# Altium project LoRaIoT.PrjPcb (part 3 of 3)

## Sheet [6] SENSORS.SchDoc: Sensors
size A4; CompanyName: RADWAG Wagi Elektroniczne; Organization: RADWAG Wagi Elektroniczne; Address1: ul. Bracka 28; Address2: 26-600 RADOM; Address3: POLAND; SheetNumber: 6; SheetTotal: 6
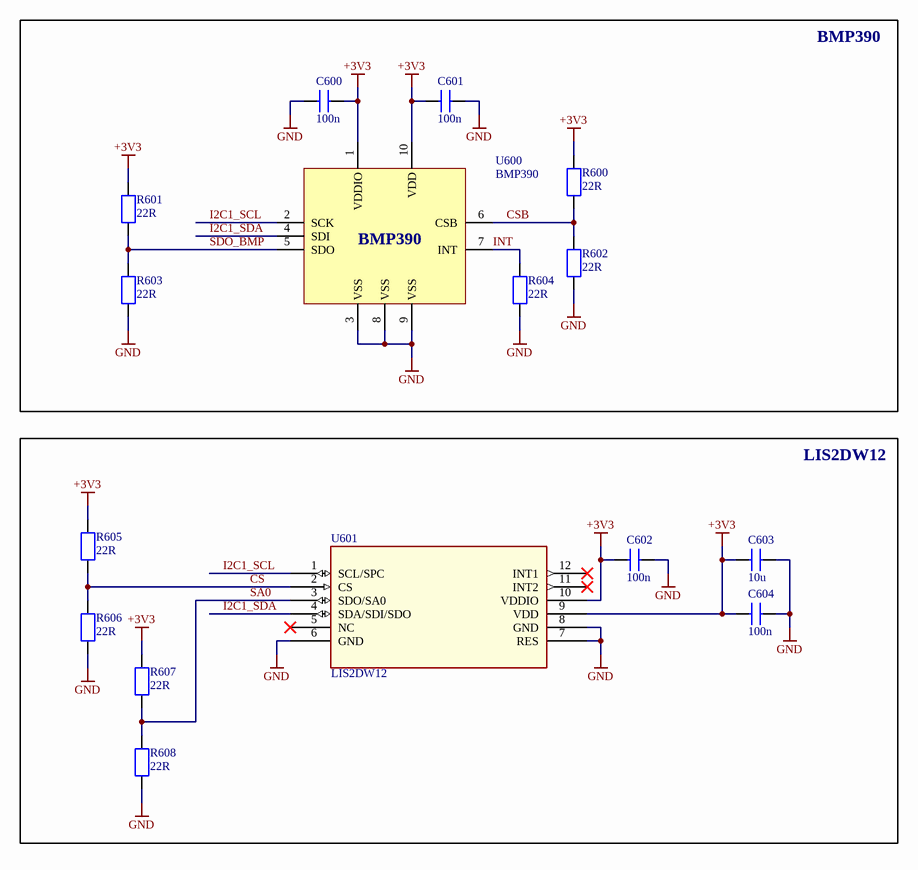
[diagram p5: [6] SENSORS.SchDoc]

### Parts
C600  100n  [C0402]
C601  100n  [C0402]
C602  100n  [C0402]
C603  10u  [C0402]
C604  100n  [C0402]
R600  22R  [R0603]
R601  22R  [R0603]
R602  22R  [R0603]
R603  22R  [R0603]
R604  22R  [R0603]
R605  22R  [R0603]
R606  22R  [R0603]
R607  22R  [R0603]
R608  22R  [R0603]
U600  BMP390  [LGA10]
U601  LIS2DW12  [LGA12]

### Blocks framed on the sheet
BMP390: C600 C601 R600-R604 U600
LIS2DW12: C602-C604 R605-R608 U601

### Nets
+3V3: C600.1 C601.2 C602.2 C603.2 C604.2 R600.2 R601.2 R605.2 R607.2 U600.1(VDDIO) U600.10(VDD) U601.9(VDD) U601.10(VDDIO)
GND: C600.2 C601.1 C602.1 C603.1 C604.1 R602.1 R603.1 R604.1 R606.1 R608.1 U600.3(VSS) U600.8(VSS) U600.9(VSS) U601.6(GND) U601.7(RES) U601.8(GND)
CS: R605.1 R606.2 U601.2(CS)
CSB: R600.1 R602.2 U600.6(CSB)
I2C1_SCL: U600.2(SCK) U601.1(SCL/SPC)
I2C1_SDA: U600.4(SDI) U601.4(SDA/SDI/SDO)
INT: R604.2 U600.7(INT)
SA0: R607.1 R608.2 U601.3(SDO/SA0)
SDO_BMP: R601.1 R603.2 U600.5(SDO)

Not connected (* = marked no-connect by the designer): U601 5(NC)* 11(INT2)* 12(INT1)*

### Notes on the sheet
- Title:
- Size: A4
- Page contents:
- Date:
- Version:
- Drawn by:
- Issue:
- Sheet number:
- of

### Library data of the parts
C600-C602 C604 = 04023C104KAT2A: Multilayer Ceramic Capacitor, 0.1 uF, 25 V, ± 10%, X7R, 0402 [1005 Metric]; Manufacturer: Kyocera AVX; Material: 4241ConductorMaterial; Value: 100nF; Voltage Rating: 25V; Supplier: Arrow Electronics; Supplier Part Number: 04023C104KAT2A; Manufacturer Part Number: 04023C104KAT2A; RoHS: Yes; Category: Ceramic Capacitors; Stock: 5700000; Pricing: 10000=0,0064, 20000=0,0061, 30000=0,0058, 50000=0,0052, 100000=0,0042, 150000=0,0038 (USD); Mounting Technology: Surface Mount; Case/Package: 0402; Pins: 2; Case Code (Metric): 1005; Case Code (Imperial): 0402; Min Operating Temperature: -55°C; Max Operating Temperature: 125°C; Tolerance: 10%; Dielectric: X7R; Packaging: Cut Tape; Voltage Rating (DC): 25V; Voltage: 25V; Series: -; Width: 1mm; Reach SVHC Compliant: No; Lead Free: Lead Free; RoHS Compliant: Yes; ComponentLink1URL: https://datasheet.ciiva.com/6265/cx7r-6265272.pdf?src-supplier=Digi-Key; ComponentLink1Description: https://datasheet.ciiva.com/6265/cx7r-6265272.pdf?src-supplier=Digi-Key; ComponentLink2URL: https://datasheet.ciiva.com/1123/1679506-1123344.pdf?src-supplier=Element14; ComponentLink2Description: https://datasheet.ciiva.com/1123/1679506-1123344.pdf?src-supplier=Element14; ComponentLink3URL: https://datasheet.ciiva.com/7709/1679506-7709527.pdf?src-supplier=Element14; ComponentLink3Description: https://datasheet.ciiva.com/7709/1679506-7709527.pdf?src-supplier=Element14; ComponentLink4URL: https://datasheet.ciiva.com/14906/cx7r-14906223.pdf?src-supplier=Digi-Key; ComponentLink4Description: https://datasheet.ciiva.com/14906/cx7r-14906223.pdf?src-supplier=Digi-Key; ComponentLink5URL: https://datasheet.ciiva.com/7614/cx7r-7614663.pdf?src-supplier=Digi-Key; ComponentLink5Description: https://datasheet.ciiva.com/7614/cx7r-7614663.pdf?src-supplier=Digi-Key
C603 = GRJ155R60J106ME11D: Capacitor Ceramic Mlcc 0402 10UF 6.3V SMD; Manufacturer: Murata; Tolerance: 20%; Supplier: Arrow Electronics; Supplier Part Number: GRJ155R60J106ME11D; Manufacturer Part Number: GRJ155R60J106ME11D; RoHS: Yes; Category: Ceramic Capacitors; Stock: 10000; Pricing: 10000=0,0311, 20000=0,0295, 30000=0,0278, 50000=0,0262, 100000=0,0221, 250000=0,0204 (USD); Mounting Technology: Surface Mount; Case/Package: 0402; Case Code (Metric): 1005; Case Code (Imperial): 0402; Min Operating Temperature: -55°C; Max Operating Temperature: 85°C; Packaging: Cut Tape; Value: 10uF; Voltage Rating: 6.3V; Features: Soft Termination; Series: GRJ; Length: 0.039inch; Width: 0.02inch; Thickness: 0.028inch; RoHS Compliant: Yes; ComponentLink1URL: https://datasheet.octopart.com/GRJ155R60J106ME11D-Murata-datasheet-149522788.pdf?src-supplier=Newark; ComponentLink1Description: https://datasheet.octopart.com/GRJ155R60J106ME11D-Murata-datasheet-149522788.pdf?src-supplier=Newark; ComponentLink2URL: http://psearch.en.murata.com/capacitor/product/GRJ155R60J106ME11%23.pdf?src-supplier=Digi-Key; ComponentLink2Description: http://psearch.en.murata.com/capacitor/product/GRJ155R60J106ME11%23.pdf?src-supplier=Digi-Key; ComponentLink3URL: https://datasheet.octopart.com/GRJ155R60J106ME11D-Murata-datasheet-165579666.pdf?src-supplier=TME; ComponentLink3Description: https://datasheet.octopart.com/GRJ155R60J106ME11D-Murata-datasheet-165579666.pdf?src-supplier=TME
R600-R608 = RC0603JR-0722RL: SMD Chip Resistor, 22 Ohm, ± 5%, 100 mW, 0603 [1608 Metric], Thick Film, General Purpose; Manufacturer: Yageo; Voltage Rating (AC): 50V; Supplier: Arrow Electronics; Supplier Part Number: RC0603JR-0722RL; Manufacturer Part Number: RC0603JR-0722RL; RoHS: Yes; Category: Chip SMD Resistors; Stock: 4035; Pricing: 1=0,0925, 10=0,0259, 25=0,0135, 100=0,005, 250=0,0047, 500=0,0043, 1000=0,0042, 3000=0,0026 (USD); ComponentLink1URL: https://datasheet.ciiva.com/7746/443971-7746471.pdf?src-supplier=Element14; ComponentLink1Description: https://datasheet.ciiva.com/7746/443971-7746471.pdf?src-supplier=Element14; ComponentLink2URL: https://datasheet.ciiva.com/7746/443971-7746472.pdf?src-supplier=Element14; ComponentLink2Description: https://datasheet.ciiva.com/7746/443971-7746472.pdf?src-supplier=Element14; ComponentLink3URL: https://datasheet.ciiva.com/46394/443971-46394999.pdf?src-supplier=Element14; ComponentLink3Description: https://datasheet.ciiva.com/46394/443971-46394999.pdf?src-supplier=Element14; ComponentLink4URL: https://datasheet.ciiva.com/15189/getdatasheetpartid-493085-15189862.pdf?src-supplier=Verical; ComponentLink4Description: https://datasheet.ciiva.com/15189/getdatasheetpartid-493085-15189862.pdf?src-supplier=Verical
U600 = BMP390: Pressure sensor, 300-1250hPa, 2.0*2.0*0.75mm, I2C/SPI; Manufacturer: Bosch Sensortec; Supplier: Future Electronics; Supplier Part Number: 3151950; Manufacturer Part Number: BMP390; RoHS: No; Category: Uncategorized
U601 = LIS2DW12TR: LIS2DW12 Series 3 Axis ±2/±4/±8/±16g 3-Axis "Femto" Accelerometer - LGA-12; Manufacturer: STMicroelectronics; Output Type: SPI,I2C; Axis: X, Y, Z; Bandwidth: 400Hz; Supplier 1: Farnell; Manufacturer Part Number: LIS2DW12TR; Stock 1: 16238; Mount: Surface Mount; Case/Package: LGA; Number of Pins: 12; Min Operating Temperature: -40°C; Max Operating Temperature: 85°C; Packaging: Cut Tape; Series: -; RoHS Compliant: Yes; ComponentLink1URL: http://www.farnell.com/datasheets/2581666.pdf?src-supplier=Farnell; ComponentLink1Description: http://www.farnell.com/datasheets/2581666.pdf?src-supplier=Farnell; ComponentLink2URL: http://www.st.com/content/ccc/resource/technical/document/datasheet/group3/30/3a/4e/6b/68/16/4a/35/DM00323179/files/DM00323179.pdf/jcr:content/translations/en.DM00323179.pdf?src-supplier=Digi-Key; ComponentLink2Description: http://www.st.com/content/ccc/resource/technical/document/datasheet/group3/30/3a/4e/6b/68/16/4a/35/DM00323179/files/DM00323179.pdf/jcr:content/translations/en.DM00323179.pdf?src-supplier=Digi-Key; ComponentLink3URL: http://www.farnell.com/datasheets/2581666.pdf?src-supplier=Newark; ComponentLink3Description: http://www.farnell.com/datasheets/2581666.pdf?src-supplier=Newark; Supplier Part Number 1: 2849615

## Nets that join several sheets
+3V3: [4] MCU (13 pins), [5] POWER (C509.2 C510.2 U502.5), [6] SENSORS (13 pins)
+VBUS: [4] MCU (5 pins), [5] POWER (6 pins)
+VDD_RADIO: [3] LORA MODULE (C300.2 C301.2 L301.1 U300.1), [5] POWER (C504.2 C505.2 U501.2 U501.4)
GND: [3] LORA MODULE (24 pins), [4] MCU (23 pins), [5] POWER (19 pins), [6] SENSORS (16 pins)
~{CTRL}: [3] LORA MODULE (R302.1), [4] MCU (U400.9)
BUSY: [3] LORA MODULE (U300.14), [4] MCU (U400.27)
I2C1_SCL: [4] MCU (R400.1 U400.29), [6] SENSORS (U600.2 U601.1)
I2C1_SDA: [4] MCU (R401.1 U400.30), [6] SENSORS (U600.4 U601.4)
NRESET: [3] LORA MODULE (U300.15), [4] MCU (U400.26)
SPI_MISO: [3] LORA MODULE (U300.16), [4] MCU (U400.12)
SPI_MOSI: [3] LORA MODULE (U300.17), [4] MCU (U400.13)
SPI_NSS: [3] LORA MODULE (U300.19), [4] MCU (U400.14)
SPI_SCK: [3] LORA MODULE (U300.18), [4] MCU (U400.11)

## Assembly variants
V1: not fitted R? R? R? R? R? R? R?